# EAGLE design sr42-revB-mlb (EAGLE 9.6.2)

## Sheet 1 of 2
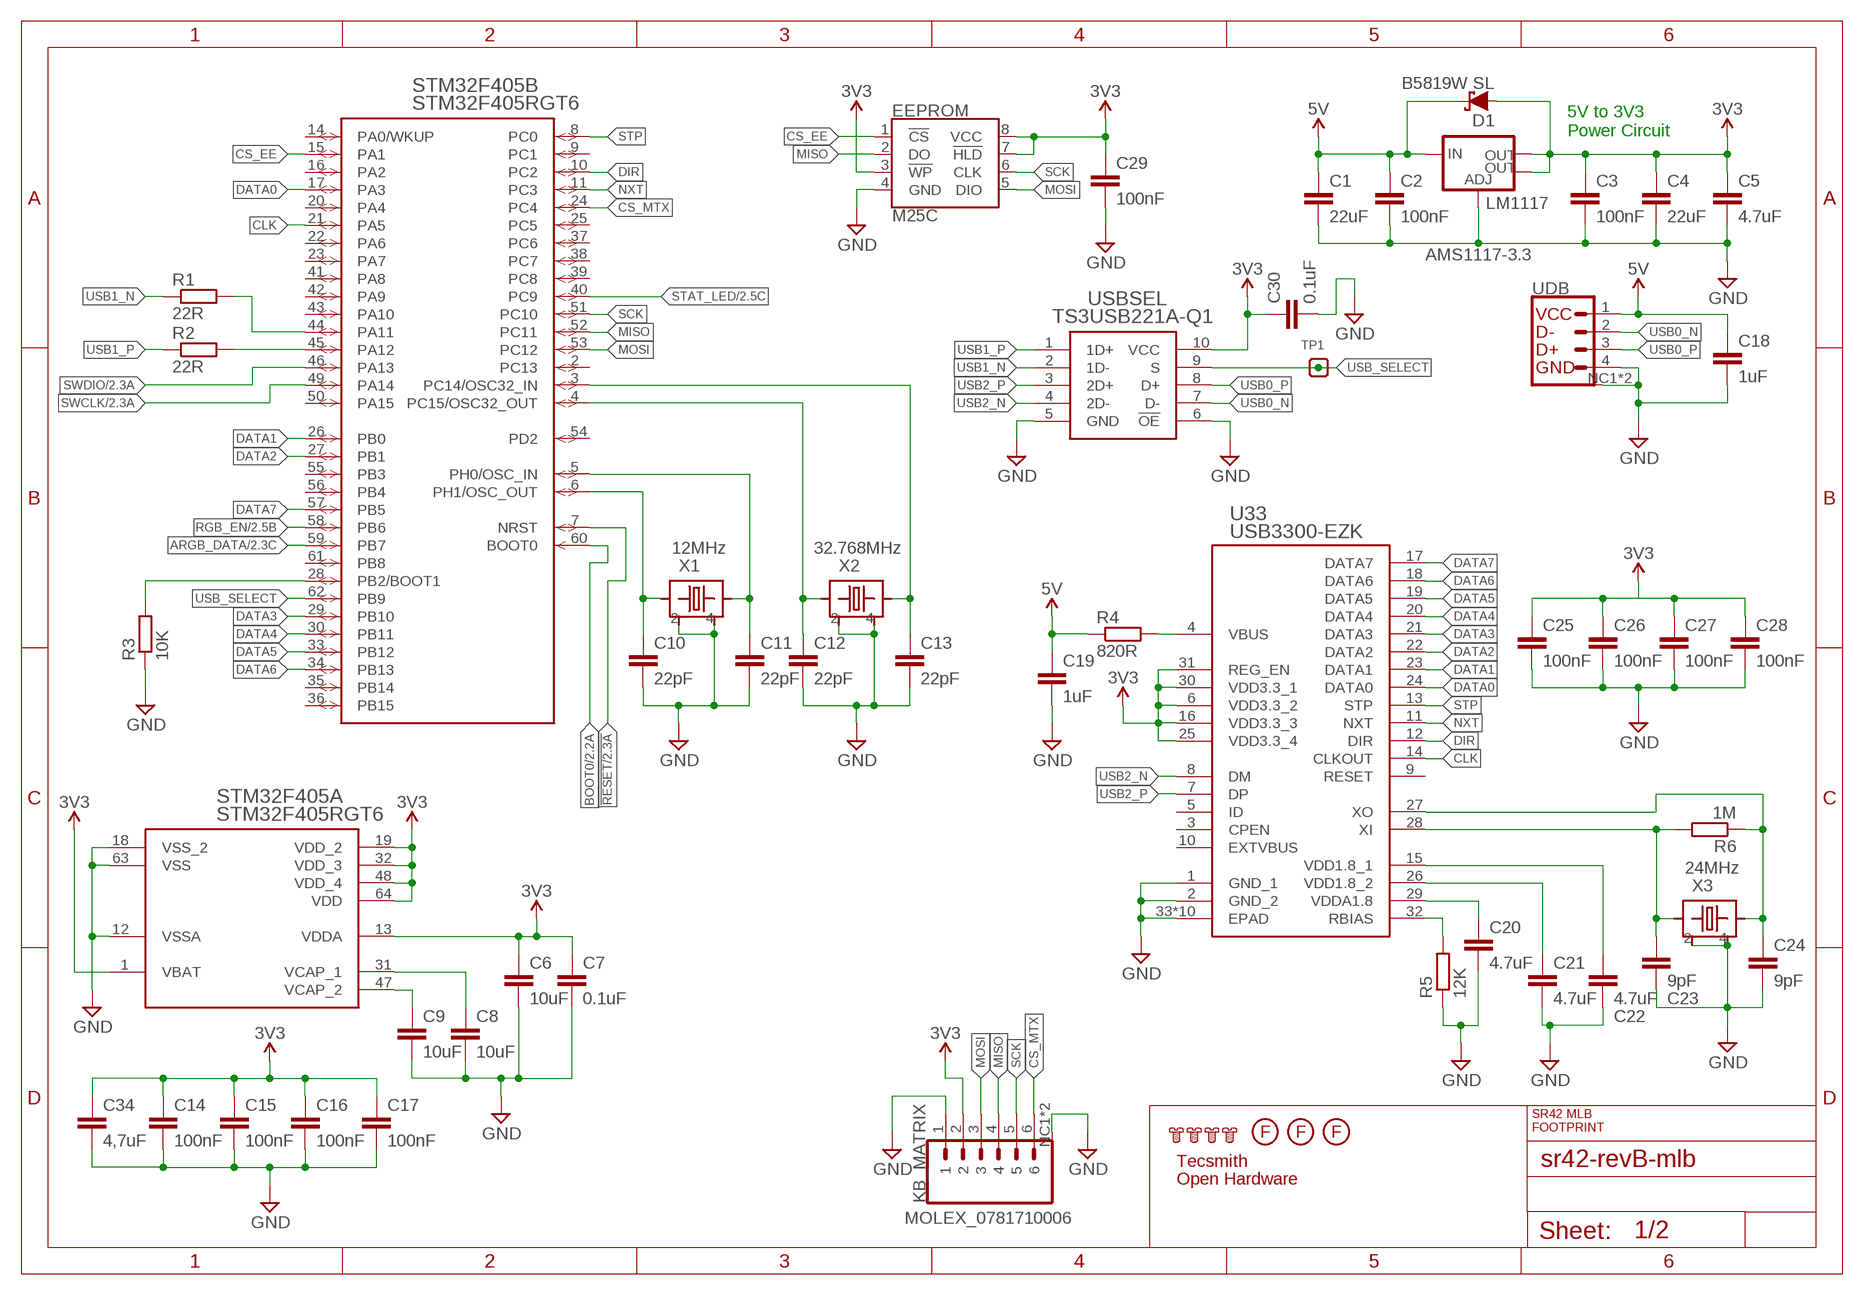
[diagram p0: schematic, sheet 1]

### Parts
C1  22uF  C-EUC0603  [C0603]
C2  100nF  C-EUC0603  [C0603]
C3  100nF  C-EUC0603  [C0603]
C4  22uF  C-EUC0603  [C0603]
C5  4.7uF  C-EUC0603  [C0603]
C6  10uF  C-EUC0603  [C0603]
C7  0.1uF  C-EUC0603  [C0603]
C8  10uF  C-EUC0603  [C0603]
C9  10uF  C-EUC0603  [C0603]
C10  22pF  C-EUC0603  [C0603]
C11  22pF  C-EUC0603  [C0603]
C12  22pF  C-EUC0603  [C0603]
C13  22pF  C-EUC0603  [C0603]
C14  100nF  C-EUC0603  [C0603]
C15  100nF  C-EUC0603  [C0603]
C16  100nF  C-EUC0603  [C0603]
C17  100nF  C-EUC0603  [C0603]
C18  1uF  C-EUC0603  [C0603]
C19  1uF  C-EUC0603  [C0603]
C20  4.7uF  C-EUC0603  [C0603]
C21  4.7uF  C-EUC0603  [C0603]
C22  4.7uF  C-EUC0603  [C0603]
C23  9pF  C-EUC0603  [C0603]
C24  9pF  C-EUC0603  [C0603]
C25  100nF  C-EUC0603  [C0603]
C26  100nF  C-EUC0603  [C0603]
C27  100nF  C-EUC0603  [C0603]
C28  100nF  C-EUC0603  [C0603]
C29  100nF  C-EUC0603  [C0603]
C30  0.1uF  C-EUC0603  [C0603]
C34  4,7uF  C-EUC0603  [C0603]
D1  B5819W SL  1N5819WS  [SOD-123]
EEPROM  M25C  [8-SOIC]
KB_MATRIX  MOLEX_0781710006  [MOLEX_781710006]
LM1117  AMS1117-3.3  V_REG_LM1117SOT223  [SOT223]
LOGO1  OSHW-LOGOM  [OSHW-LOGO-M]
R1  22R  R-EU_R0603  [R0603]
R2  22R  R-EU_R0603  [R0603]
R3  10K  R-EU_R0603  [R0603]
R4  820R  R-EU_R0603  [R0603]
R5  12K  R-EU_R0603  [R0603]
R6  1M  R-EU_R0603  [R0603]
STM32F405  STM32F405RGT6  [LQFP64-10X10MM]
TP1  TEST-POINT.3RN  [PAD.03X.03-RN]
U33  USB3300-EZK  [QFN32_5X5MC_MCH]
U$1  SR42_MLB_FOOTPRINT  [SR42_MLB_FOOTPRINT]
U$2  MOUNTING-HOLE  [MOUNTING-HOLE]
U$3  MOUNTING-HOLE  [MOUNTING-HOLE]
U$4  MOUNTING-HOLE  [MOUNTING-HOLE]
U$5  MOUNTING-HOLE  [MOUNTING-HOLE]
U$6  TECSMITH-LOGOLONG  [TECSMITH-NAME]
U$7  FIDUCIAL  [FIDUCIAL]
U$8  FIDUCIAL  [FIDUCIAL]
U$9  FIDUCIAL  [FIDUCIAL]
UDB  UBD-S1_C4  [MOLEX_781710004]
USBSEL  TS3USB221A-Q1  [RSE10]
X1  12MHz  CRYSTAL2.5X2.0  [CRYSTAL_2.5X2]
X2  32.768MHz  CRYSTAL2.5X2.0  [CRYSTAL_2.5X2]
X3  24MHz  CRYSTAL2.5X2.0  [CRYSTAL_2.5X2]

### Nets
!RESET: STM32F405.7(B:NRST) ; also sheet 2
ARGB_DATA: STM32F405.59(B:PB7) ; also sheet 2
BOOT0: STM32F405.60(B:BOOT0) ; also sheet 2
BOOT1: R3.2 STM32F405.28(B:PB2/BOOT1)
CLK: STM32F405.21(B:PA5) U33.14(CLKOUT)
CS_EE: EEPROM.1(!CS) STM32F405.15(B:PA1)
CS_MTX: KB_MATRIX.6 STM32F405.24(B:PC4)
DATA0: STM32F405.17(B:PA3) U33.24(DATA0)
DATA1: STM32F405.26(B:PB0) U33.23(DATA1)
DATA2: STM32F405.27(B:PB1) U33.22(DATA2)
DATA3: STM32F405.29(B:PB10) U33.21(DATA3)
DATA4: STM32F405.30(B:PB11) U33.20(DATA4)
DATA5: STM32F405.33(B:PB12) U33.19(DATA5)
DATA6: STM32F405.34(B:PB13) U33.18(DATA6)
DATA7: STM32F405.57(B:PB5) U33.17(DATA7)
DIR: STM32F405.10(B:PC2) U33.12(DIR)
GND [gnd]: C1.2 C2.2 C3.2 C4.2 C5.2 C6.2 C7.2 C8.2 C9.2 C10.2 C11.2 C12.2 C13.2 C14.2 C15.2 C16.2 C17.2 C18.2 C19.2 C20.2 C21.2 C22.2 C23.2 C24.2 C25.2 C26.2 C27.2 C28.2 C29.2 C30.2 C34.2 EEPROM.4(GND) KB_MATRIX.1 KB_MATRIX.NC1(M) KB_MATRIX.NC2(M) LM1117.1(ADJ) R3.1 R5.1 STM32F405.12(A:VSSA) STM32F405.18(A:VSS_2) STM32F405.63(A:VSS) U33.1(GND_1) U33.2(GND_2) U33.33(EPAD) U33.P$1(EPAD) U33.P$2(EPAD) U33.P$3(EPAD) U33.P$4(EPAD) U33.P$5(EPAD) U33.P$6(EPAD) U33.P$7(EPAD) U33.P$8(EPAD) U33.P$9(EPAD) UDB.4(GND) UDB.NC1(M) UDB.NC2(M) USBSEL.5(GND) USBSEL.6(!OE) X1.2 X1.4 X2.2 X2.4 X3.2 X3.4 ; also sheet 2
MISO: EEPROM.2(DO) KB_MATRIX.4 STM32F405.52(B:PC11)
MOSI: EEPROM.5(DIO) KB_MATRIX.3 STM32F405.53(B:PC12)
N$1: R1.2 STM32F405.44(B:PA11)
N$4: R2.2 STM32F405.45(B:PA12)
N$5: R4.2 U33.4(VBUS)
N$6: C20.1 U33.29(VDDA1.8)
N$7: C21.1 U33.26(VDD1.8_2)
N$8: C22.1 U33.15(VDD1.8_1)
N$9: C23.1 R6.2 U33.28(XI) X3.1
N$10: C24.1 R6.1 U33.27(XO) X3.3
NXT: STM32F405.11(B:PC3) U33.11(NXT)
OSC32_IN: C13.1 STM32F405.3(B:PC14/OSC32_IN) X2.3
OSC32_OUT: C12.1 STM32F405.4(B:PC15/OSC32_OUT) X2.1
OSC_IN: C11.1 STM32F405.5(B:PH0/OSC_IN) X1.3
OSC_OUT: C10.1 STM32F405.6(B:PH1/OSC_OUT) X1.1
RBIAS: R5.2 U33.32(RBIAS)
RGB_EN: STM32F405.58(B:PB6) ; also sheet 2
SCK: EEPROM.6(CLK) KB_MATRIX.5 STM32F405.51(B:PC10)
STAT_LED: STM32F405.40(B:PC9) ; also sheet 2
STP: STM32F405.8(B:PC0) U33.13(STP)
SWCLK: STM32F405.49(B:PA14) ; also sheet 2
SWDIO: STM32F405.46(B:PA13) ; also sheet 2
USB0_N: UDB.2(DN) USBSEL.7(D-)
USB0_P: UDB.3(DP) USBSEL.8(D+)
USB1_N: R1.1 USBSEL.2(1D-)
USB1_P: R2.1 USBSEL.1(1D+)
USB2_N: U33.8(DM) USBSEL.4(2D-)
USB2_P: U33.7(DP) USBSEL.3(2D+)
USB_SELECT: STM32F405.62(B:PB9) TP1.1 USBSEL.9(S)
VCAP1: C8.1 STM32F405.31(A:VCAP_1)
VCAP2: C9.1 STM32F405.47(A:VCAP_2)
VCC_1: C1.1 C2.1 C18.1 C19.1 D1.C LM1117.3(IN) R4.1 UDB.1(VCC) ; supply symbol labelled 5V ; also sheet 2
VCC_2: C3.1 C4.1 C5.1 C6.1 C7.1 C14.1 C15.1 C16.1 C17.1 C25.1 C26.1 C27.1 C28.1 C29.1 C30.1 C34.1 D1.A EEPROM.3(!WP) EEPROM.7(!HLD) EEPROM.8(VCC) KB_MATRIX.2 LM1117.2(OUT) LM1117.4(OUT) STM32F405.1(A:VBAT) STM32F405.13(A:VDDA) STM32F405.19(A:VDD_2) STM32F405.32(A:VDD_3) STM32F405.48(A:VDD_4) STM32F405.64(A:VDD) U33.6(VDD3.3_2) U33.16(VDD3.3_3) U33.25(VDD3.3_4) U33.30(VDD3.3_1) U33.31(REG_EN) USBSEL.10(VCC) ; supply symbol labelled 3V3 ; also sheet 2
Unconnected: STM32F405.2(B:PC13) STM32F405.9(B:PC1) STM32F405.14(B:PA0/WKUP) STM32F405.16(B:PA2) STM32F405.20(B:PA4) STM32F405.22(B:PA6) STM32F405.23(B:PA7) STM32F405.25(B:PC5) STM32F405.35(B:PB14) STM32F405.36(B:PB15) STM32F405.37(B:PC6) STM32F405.38(B:PC7) STM32F405.39(B:PC8) STM32F405.41(B:PA8) STM32F405.42(B:PA9) STM32F405.43(B:PA10) STM32F405.50(B:PA15) STM32F405.54(B:PD2) STM32F405.55(B:PB3) STM32F405.56(B:PB4) STM32F405.61(B:PB8) U33.3(CPEN) U33.5(ID) U33.9(RESET) U33.10(EXTVBUS)

### Notes on the sheet
- 5V to 3V3
  Power Circuit

## Sheet 2 of 2
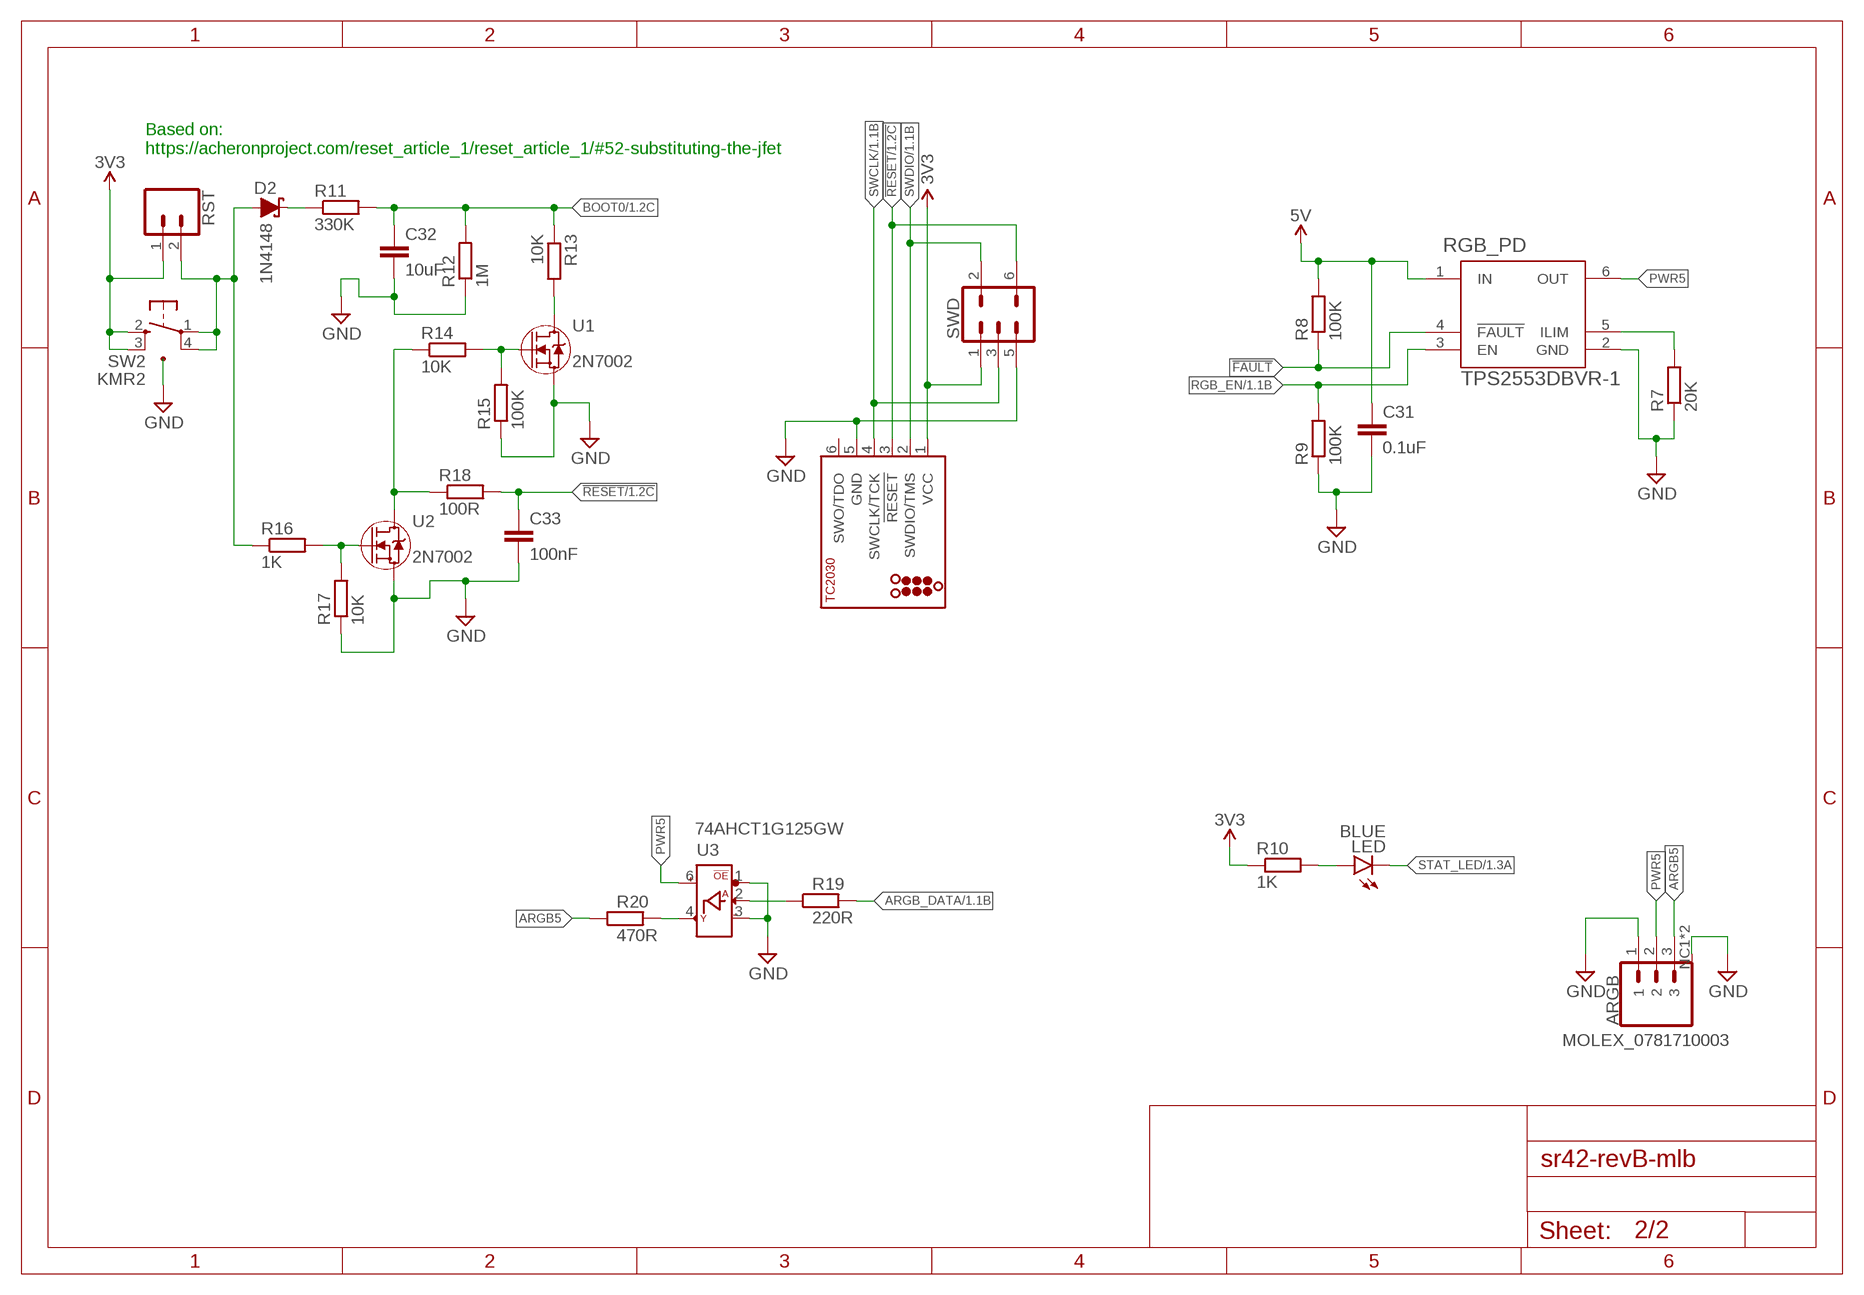
[diagram p1: schematic, sheet 2]

### Parts
ARGB  MOLEX_0781710003  [MOLEX_781710003]
C31  0.1uF  C-EUC0603  [C0603]
C32  10uF  C-EUC0603  [C0603]
C33  100nF  C-EUC0603  [C0603]
D2  1N4148  1N5819WS  [SOD-123]
LED  BLUE  LEDSML0603  [SML0603]
R7  20K  R-EU_R0603  [R0603]
R8  100K  R-EU_R0603  [R0603]
R9  100K  R-EU_R0603  [R0603]
R10  1K  R-EU_R0603  [R0603]
R11  330K  R-EU_R0603  [R0603]
R12  1M  R-EU_R0603  [R0603]
R13  10K  R-EU_R0603  [R0603]
R14  10K  R-EU_R0603  [R0603]
R15  100K  R-EU_R0603  [R0603]
R16  1K  R-EU_R0603  [R0603]
R17  10K  R-EU_R0603  [R0603]
R18  100R  R-EU_R0603  [R0603]
R19  220R  R-EU_R0603  [R0603]
R20  470R  R-EU_R0603  [R0603]
RGB_PD  TPS2553DBVR-1  [DBV0006A_N]
RST  CONN_02  [1X02]
SW2  KMR2  KMR221GLFSSW4_KMR221GLFS_CNK  [SW4_KMR221GLFS_CNK]
SWD  SWD-5PIN  [PAD_05_03X2_TP_NO4]
TC  TC2030-MCP-NL  [TC2030-MCP-NL]
U1  2N7002  [TO-236AB_NEX]
U2  2N7002  [TO-236AB_NEX]
U3  74AHCT1G125GW  [SC-88A__TSSOP5__SOT353-1]

### Nets
!FAULT: R8.1 RGB_PD.4(!FAULT)
!RESET: C33.1 R18.2 SWD.6 TC.3(!RESET) ; also sheet 1
ARGB5: ARGB.3 R20.1
ARGB_DATA: R19.2 ; also sheet 1
BOOT0: C32.1 R11.2 R12.2 R13.1 ; also sheet 1
GND [gnd]: ARGB.1 ARGB.NC1(M) ARGB.NC2(M) C31.2 C32.2 C33.2 R7.1 R9.1 R12.1 R15.1 R17.1 RGB_PD.2(GND) SW2.5 SWD.5 TC.5(GND) U1.2 U2.2 U3.1(!OE) U3.3(3_GND) ; also sheet 1
N$11: D2.C R11.1
N$12: LED.A R10.2
N$14: R7.2 RGB_PD.5(ILIM)
N$15: R14.1 R18.1 U2.3
N$16: R13.2 U1.3
N$17: R14.2 R15.2 U1.1
N$18: R19.1 U3.2(A_DIN)
N$19: R16.2 R17.2 U2.1
N$20: D2.A R16.1 RST.2 SW2.1 SW2.4
N$22: R20.2 U3.4(Y_DOUT)
PWR5: ARGB.2 RGB_PD.6(OUT) U3.6(5_VCC)
RGB_EN: R9.2 RGB_PD.3(EN) ; also sheet 1
STAT_LED: LED.C ; also sheet 1
SWCLK: SWD.3 TC.4(SWCLK/TCK) ; also sheet 1
SWDIO: SWD.2 TC.2(SWDIO/TMS) ; also sheet 1
VCC_1: C31.1 R8.2 RGB_PD.1(IN) ; supply symbol labelled 5V ; also sheet 1
VCC_2: R10.1 RST.1 SW2.2 SW2.3 SWD.1 TC.1(VCC) ; supply symbol labelled 3V3 ; also sheet 1
Unconnected: TC.6(SWO/TDO)

### Notes on the sheet
- Based on:
  https://acheronproject.com/reset_article_1/reset_article_1/#52-substituting-the-jfet

## Power pins joined to a net without a drawn wire
P$1: U$2.P$1 U$2.P$2 U$2.P$3 U$2.P$4 U$2.P$5 U$2.P$6 U$3.P$1 U$3.P$2 U$3.P$3 U$3.P$4 U$3.P$5 U$3.P$6 U$4.P$1 U$4.P$2 U$4.P$3 U$4.P$4 U$4.P$5 U$4.P$6 U$5.P$1 U$5.P$2 U$5.P$3 U$5.P$4 U$5.P$5 U$5.P$6

## Library data of the parts
ARGB = molex-pico-ezmate:MOLEX_0781710003
C1-C34 = rcl:C-EU: CAPACITOR, European symbol; SPICEPREFIX: C
D1 D2 = tecsmith_jlcpcb_basic_parts:1N5819WS: JLCPCB Part # C8598 Description 40V 600mV@1A 1A SOD-123 Schottky Barrier Diodes (SBD) ROHS Schottky Diode
EEPROM = ts_kb_mcu:M25C
KB_MATRIX = molex-pico-ezmate:MOLEX_0781710006
LED = led:LED: LED OSRAM: - CHIPLED LG R971, LG N971, LY N971, LG Q971, LY Q971, LO R971, LY R971 LH N974, LH R974 LS Q976, LO Q976, LY Q976 LO Q996 - Hyper CHIPLED LW Q18S LB Q993, LB Q99A, LB R99A - SideLED LS A670, LO A670, LY A670, LG A670, LP A670 LB A673, LV A673, LT A673, LW A673 LH A674 LY A675 LS A676, LA A676, LO A676, LY A676, LW A676 LS A679, LY A679, LG A679 - Hyper Micro SIDELED® LS Y876, LA Y876, LO Y876, LY Y876 LT Y87S - SmartLED LW L88C, LW L88S LB L89C, LB L89S, LG L890 LS L89K, LO L89K, LY L89K LS L896, LA L896, LO L896, LY L896 - TOPLED LS T670, LO T670, LY T670, LG T670, LP T670 LSG T670, LSP T670, LSY T670, LOP T670, LYG T670 LG T671, LOG T671, LSG T671 LB T673, LV T673, LT T673, LW T673 LH T674 LS T676, LA T676, LO T676, LY T676, LB T676, LH T676, LSB T676, LW T676 LB T67C, LV T67C, LT T67C, LS T67K, LO T67K, LY T67K, LW E67C LS E67B, LA E67B, LO E67B, LY E67B, LB E67C, LV E67C, LT E67C LW T67C LS T679, LY T679, LG T679 LS T770, LO T770, LY T770, LG T770, LP T770 LB T773, LV T773, LT T773, LW T773 LH T774 LS E675, LA E675, LY E675, LS T675 LS T776, LA T776, LO T776, LY T776, LB T776 LHGB T686 LT T68C, LB T68C - Hyper Mini TOPLED® LB M676 - Mini TOPLED Santana® LG M470 LS M47K, LO M47K, LY M47K Source: http://www.osram.convergy.de LUXEON: - LUMILED® LXK2-PW12-R00, LXK2-PW12-S00, LXK2-PW14-U00, LXK2-PW14-V00 LXK2-PM12-R00, LXK2-PM12-S00, LXK2-PM14-U00 LXK2-PE12-Q00, LXK2-PE12-R00, LXK2-PE12-S00, LXK2-PE14-T00, LXK2-PE14-U00 LXK2-PB12-K00, LXK2-PB12-L00, LXK2-PB12-M00, LXK2-PB14-N00, LXK2-PB14-P00, LXK2-PB14-Q00 LXK2-PR12-L00, LXK2-PR12-M00, LXK2-PR14-Q00, LXK2-PR14-R00 LXK2-PD12-Q00, LXK2-PD12-R00, LXK2-PD12-S00 LXK2-PH12-R00, LXK2-PH12-S00 LXK2-PL12-P00, LXK2-PL12-Q00, LXK2-PL12-R00 Source: www.luxeon.com KINGBRIGHT: KA-3528ASYC Source: www.kingbright.com
LM1117 = SparkFun-IC-Power:V_REG_LM1117: Voltage Regulator LM1117 Standard adjustable voltage regulator but in SMD form. Spark Fun Electronics SKU : COM-00595; PROD_ID: VREG-08170
LOGO1 = random_logos:OSHW-LOGO: Open-Source Hardware (OSHW) Logo This logo indicates the piece of hardware it is found on incorporates a OSHW license and/or adheres to the definition of open source hardware found here: http://freedomdefined.org/OSHW
R1-R20 = rcl:R-EU_: RESISTOR, European symbol; SPICEPREFIX: R
RGB_PD = __untitled:TPS2553DBVR-1; COPYRIGHT: Copyright (C) 2024 Ultra Librarian. All rights reserved.; MANUFACTURER_PART_NUMBER: TPS2553DBVR-1; MFR_NAME: Texas Instruments; REFDES: RefDes; TYPE: TYPE
RST = SparkFun-Connectors:CONN_02: Multi connection point. Often used as Generic Header-pin footprint for 0.1 inch spaced/style header connections On any of the 0.1 inch spaced packages, you can populate with these: Break Away Headers - Straight <https://www.sparkfun.com/products/116> (PRT-00116) Break Away Male Headers - Right Angle <https://www.sparkfun.com/products/553> (PRT-00553) Female Headers <https://www.sparkfun.com/products/115> (PRT-00115) Break Away Headers - Machine Pin <https://www.sparkfun.com/products/117> (PRT-00117) Break Away Female Headers - Swiss Machine Pin <https://www.sparkfun.com/products/743> (PRT-00743) For SCREWTERMINALS and SPRING TERMINALS visit here: Screw Terimnals on SparkFun.com <https://www.sparkfun.com/search/results?term=Screw+Terminals> (5mm/3.5mm/2.54mm spacing) This device is also useful as a general connection point to wire up your design to another part of your project. Our various solder wires solder well into these plated through hole pads. Hook-Up Wire - Assortment (Stranded, 22 AWG) <https://www.sparkfun.com/products/11375> (PRT-11375) Hook-Up Wire - Assortment (Solid Core, 22 AWG) <https://www.sparkfun.com/products/11367> (PRT-11367) View the entire wire category on our website here <https://www.sparkfun.com/categories/141> Special notes: Molex polarized connector foot print use with: PRT-08233 with associated crimp pins and housings. 2.54_SCREWTERM for use with PRT-10571. 3.5mm Screw Terminal footprints for PRT-08084 5mm Screw Terminal footprints for use with PRT-08432
STM32F405 = st:STM32F405RGT6
SW2 = 2024-11-04_19-55-01_Library:KMR221GLFS
SWD = SparkFun-Connectors:SWD-5PIN: 5-pin SWD connector Test-point based header for SWD. Pin 1 - PWR Pin 2 - SWDIO Pin 3 - SWCLK Pin 4 - NC Pin 5 - GND Pin 6 - RESET
TC = __untitled:TC2030: TAG-CONNECT ICSP Connector Manufacturer: Tag-Connect <http://www.tag-connect.com> Cable for easy In-Circuit Serial Programming. Designed for Microchip ICD2, suitable for many others. Two variants - one "with legs" (for hands-free fit on PCB) and another "without legs" for quick programming. PAD Description 1 MCLR/Vpp 2 Vdd 3 GND 4 PGD (ISPDAT) 5 PGC (ISPCLK) 6 nc (used for LVP) ©2009 ROFA.cz - modified and updated by Robert Darlington ‹rdarlington@gmail.com›
TP1 = tecsmith_keyboards:TEST-POINT
U1 U2 = __temp_to_delete:2N7002; COPYRIGHT: Copyright (C) 2024 Ultra Librarian. All rights reserved.; MANUFACTURER_PART_NUMBER: 2N7002,215; MFR_NAME: Nexperia
U3 = ts_keyboards:74AHCT1G125GW
U33 = ts_kb_mcu:USB3300-EZK; COPYRIGHT: Copyright (C) 2023 Ultra Librarian. All rights reserved.; MANUFACTURER_PART_NUMBER: USB3300-EZK; MFR_NAME: Microchip
U$1 = __temp_to_delete:SR42_MLB_FOOTPRINT
U$2-U$5 = ts_keyboards:MOUNTING-HOLE
U$6 = random_logos:TECSMITH-LOGO
U$7-U$9 = __temp_to_delete:FIDUCIAL
UDB = ts_keyboards:UBD-S1_C4: SMD 1.2mm pitch Molex Pico-EZmate 4P connector
USBSEL = ts_kb_mcu:TS3USB221A-Q1; COPYRIGHT: Copyright (C) 2023 Ultra Librarian. All rights reserved.; MANUFACTURER_PART_NUMBER: TS3USB221AQRSERQ1; MFR_NAME: Texas Instruments
X1-X3 = __temp_to_delete:CRYSTAL

## Net classes
1 power: width 0.305 mm
2 gnd: width 0.254 mm

## Board
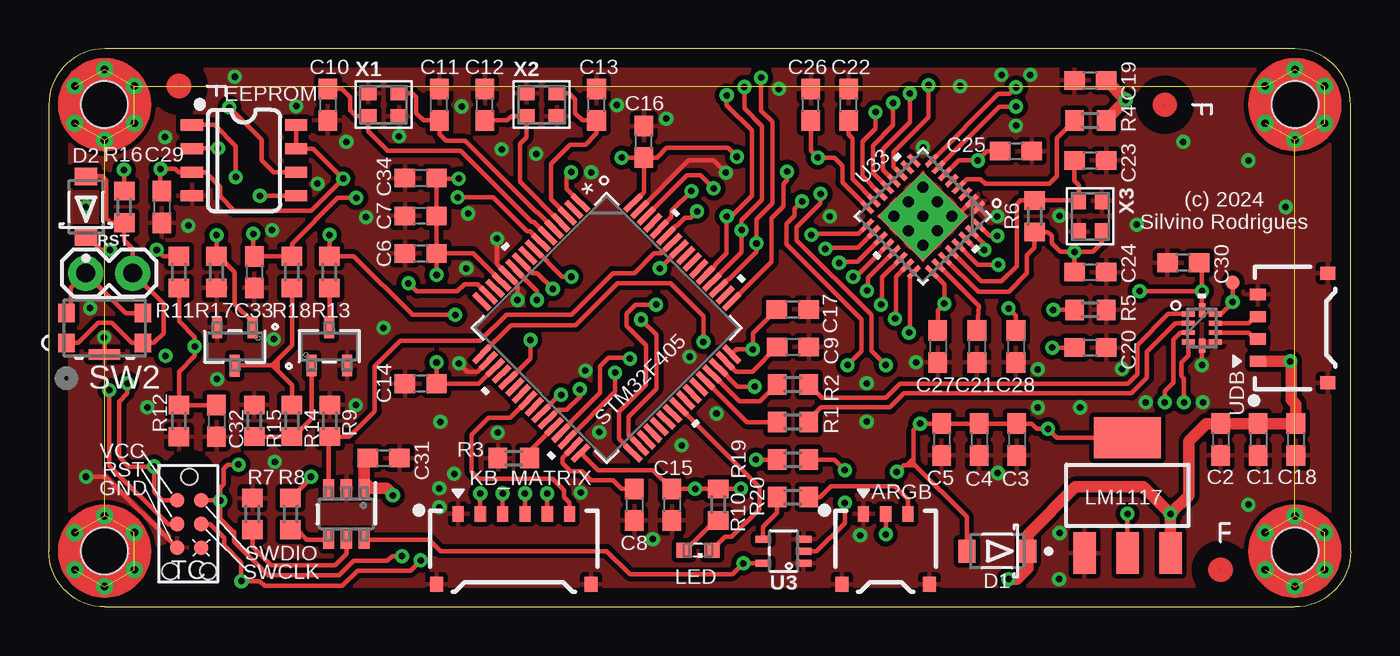
[diagram p2: board, top side]
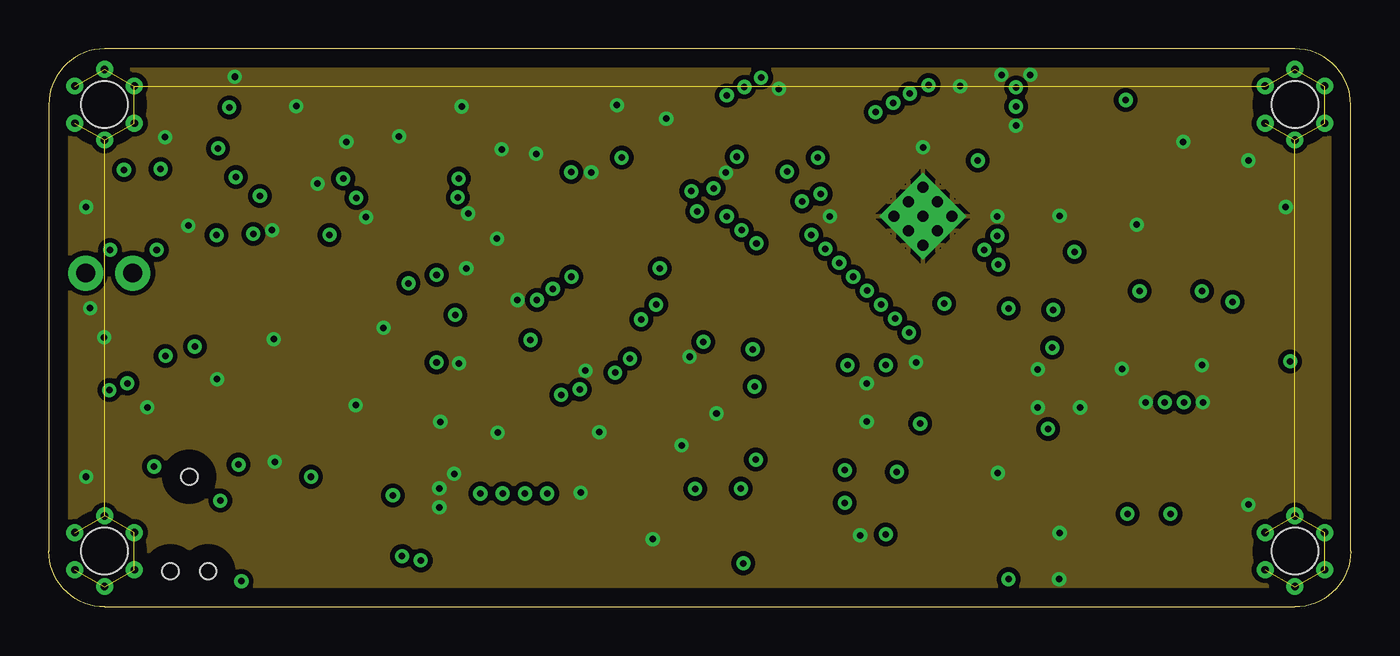
[diagram p3: board, inner layer Route2]
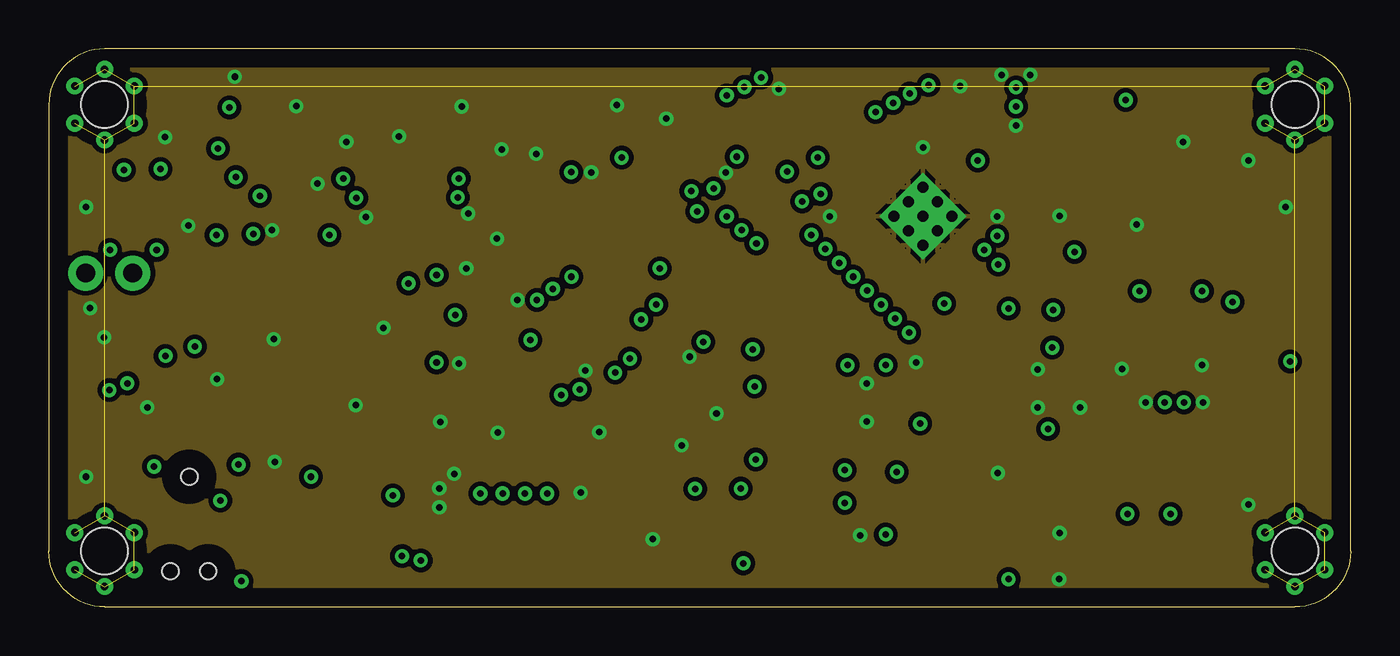
[diagram p4: board, inner layer Route15]
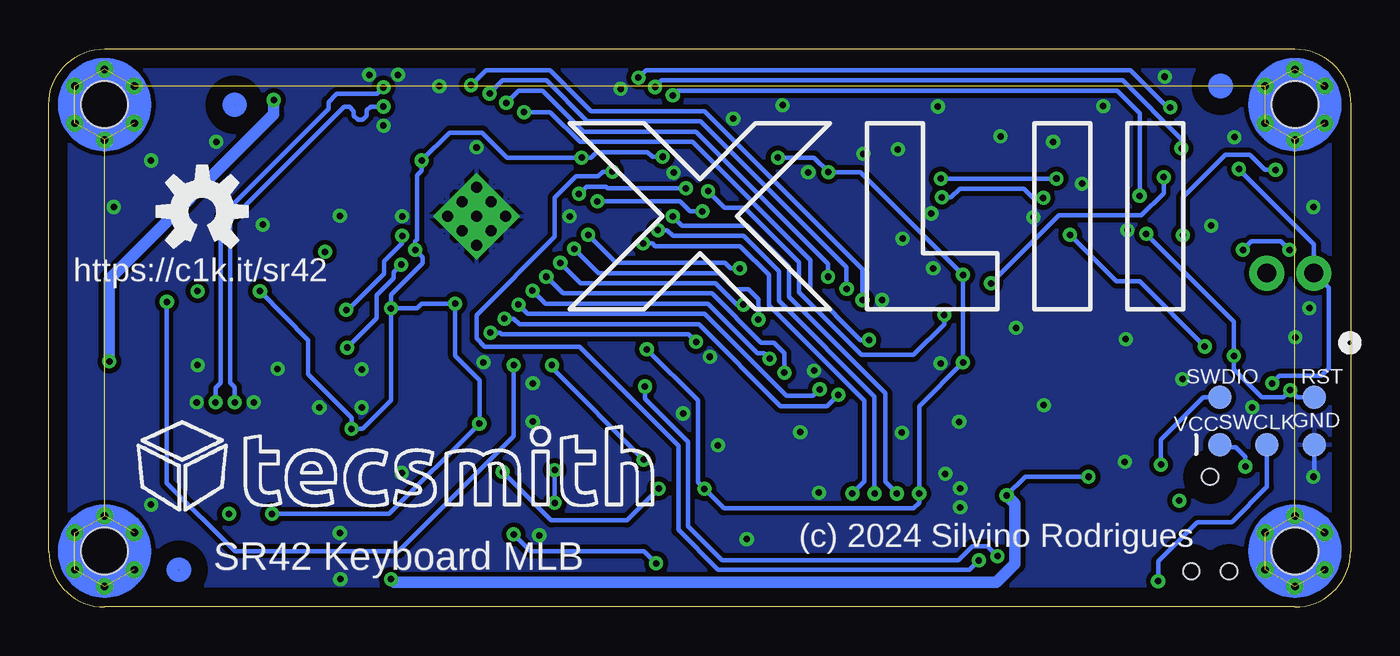
[diagram p5: board, bottom side, seen from below]

Size 70 x 30 mm. Coordinates in mm from the lower left corner, seen from the top.
Outline: 3,0 67,0 arc90 70,3 70,27 arc90 67,30 3,30 arc90 0,27 0,3 arc90 3,0
Copper layers (1+2*15+16): Top 0.035mm / dielectric 0.2mm / Route2 0.0175mm / dielectric 1.065mm / Route15 0.0175mm / dielectric 0.2mm / Bottom 0.035mm
Design rules "default *": minimum track width 6mil, minimum drill 0.35mm, track to track 10mil, track to pad 10mil, pad to pad 10mil, via to via 10mil, smd to smd 10mil, copper to edge 40mil, drill to drill 6mil, minimum pad ring 10mil, minimum via ring 8mil, stop-mask expansion 4mil, vias tented up to drill 0mil, thermal gap 10mil

### Footprints (pad centres in the part's own frame; a part is rotated, then mirrored left to right if it is on the bottom)
MOLEX_781710003 = smd 0.6 x 0.85: 1 -1.2,2; 2 0,2; 3 1.2,2 | smd 0.7 x 0.8: NC1 -2.35,-1.775; NC2 2.35,-1.775
C0603 = smd 1.1 x 1: 1 -0.85,0; 2 0.85,0
SOD-123 = smd 0.914 x 1.219: A 1.638,0; C -1.638,0
8-SOIC = smd 0.6 x 1.2: 1 -1.905,-2.8; 2 -0.635,-2.8; 3 0.635,-2.8; 4 1.905,-2.8; 5 1.905,2.8; 6 0.635,2.8; 7 -0.635,2.8; 8 -1.905,2.8
MOLEX_781710006 = smd 0.6 x 0.85: 1 -3,2; 2 -1.8,2; 3 -0.6,2; 4 0.6,2; 5 1.8,2; 6 3,2 | smd 0.7 x 0.8: NC1 -4.15,-1.775; NC2 4.15,-1.775
SML0603 = smd 0.8 x 0.8: A 0.75,0; C -0.75,0
SOT223 = smd 1.219 x 2.235: 1 -2.311,-3.099; 2 0,-3.099; 3 2.311,-3.099 | smd 3.6 x 2.2: 4 0,3.099
R0603 = smd 1 x 1.1: 1 -0.85,0; 2 0.85,0
DBV0006A_N = smd 1 x 0.6: 1 -1.375,0.95; 2 -1.375,0; 3 -1.375,-0.95; 4 1.375,-0.95; 5 1.375,0; 6 1.375,0.95
1X02 = drill 1.016 pad 1.88: 1 0,0; 2 2.54,0
LQFP64-10X10MM = smd 1.194 x 0.305: 1 -5.75,3.75; 2 -5.75,3.25; 3 -5.75,2.75; 4 -5.75,2.25; 5 -5.75,1.75; 6 -5.75,1.25; 7 -5.75,0.75; 8 -5.75,0.25; 9 -5.75,-0.25; 10 -5.75,-0.75; 11 -5.75,-1.25; 12 -5.75,-1.75; 13 -5.75,-2.25; 14 -5.75,-2.75; 15 -5.75,-3.25; 16 -5.75,-3.75; 33 5.75,-3.75; 34 5.75,-3.25; 35 5.75,-2.75; 36 5.75,-2.25; 37 5.75,-1.75; 38 5.75,-1.25; 39 5.75,-0.75; 40 5.75,-0.25; 41 5.75,0.25; 42 5.75,0.75; 43 5.75,1.25; 44 5.75,1.75; 45 5.75,2.25; 46 5.75,2.75; 47 5.75,3.25; 48 5.75,3.75 | smd 0.305 x 1.194: 17 -3.75,-5.75; 18 -3.25,-5.75; 19 -2.75,-5.75; 20 -2.25,-5.75; 21 -1.75,-5.75; 22 -1.25,-5.75; 23 -0.75,-5.75; 24 -0.25,-5.75; 25 0.25,-5.75; 26 0.75,-5.75; 27 1.25,-5.75; 28 1.75,-5.75; 29 2.25,-5.75; 30 2.75,-5.75; 31 3.25,-5.75; 32 3.75,-5.75; 49 3.75,5.75; 50 3.25,5.75; 51 2.75,5.75; 52 2.25,5.75; 53 1.75,5.75; 54 1.25,5.75; 55 0.75,5.75; 56 0.25,5.75; 57 -0.25,5.75; 58 -0.75,5.75; 59 -1.25,5.75; 60 -1.75,5.75; 61 -2.25,5.75; 62 -2.75,5.75; 63 -3.25,5.75; 64 -3.75,5.75
SW4_KMR221GLFS_CNK = smd 0.889 x 0.991: 1 2.05,0.8; 2 2.05,-0.8; 3 -2.05,-0.8; 4 -2.05,0.8 | smd 1.7 x 0.55: 5 0,1.425
PAD_05_03X2_TP_NO4 = smd 1.27 x 1.27: 1 -2.54,-1.27; 2 -2.54,1.27; 3 0,-1.27; 5 2.54,-1.27; 6 2.54,1.27
TC2030-MCP-NL = smd 0.787 x 0.787: 1 1.27,-0.635; 2 1.27,0.635; 3 2.54,-0.635; 4 2.54,0.635; 5 3.81,-0.635; 6 3.81,0.635 | hole 0.889: 0,0; 5.08,-1.016; 5.08,1.016
PAD.03X.03-RN = smd 0.762 x 0.762: 1 0,0
TO-236AB_NEX = smd 0.533 x 1.168: 1 -0.953,-1.029; 2 0.953,-1.029; 3 0,1.029
SC-88A__TSSOP5__SOT353-1 = smd 0.375 x 0.825: 1 -0.65,-1.087; 2 0,-1.087; 3 0.65,-1.087; 4 0.65,1.087; 6 -0.65,1.087
QFN32_5X5MC_MCH = smd 0.813 x 0.254: 1 -2.451,1.778; 2 -2.451,1.27; 3 -2.451,0.762; 4 -2.451,0.254; 5 -2.451,-0.254; 6 -2.451,-0.762; 7 -2.451,-1.27; 8 -2.451,-1.778; 17 2.451,-1.778; 18 2.451,-1.27; 19 2.451,-0.762; 20 2.451,-0.254; 21 2.451,0.254; 22 2.451,0.762; 23 2.451,1.27; 24 2.451,1.778 | smd 0.254 x 0.813: 9 -1.778,-2.451; 10 -1.27,-2.451; 11 -0.762,-2.451; 12 -0.254,-2.451; 13 0.254,-2.451; 14 0.762,-2.451; 15 1.27,-2.451; 16 1.778,-2.451; 25 1.778,2.451; 26 1.27,2.451; 27 0.762,2.451; 28 0.254,2.451; 29 -0.254,2.451; 30 -0.762,2.451; 31 -1.27,2.451; 32 -1.778,2.451 | smd 3.404 x 3.404: 33 0,0 | drill 0.6 square: P$1 -1.1,1.1; P$2 0,1.1; P$3 1.1,1.1; P$4 -1.1,0; P$5 0,0; P$6 1.1,0; P$7 -1.1,-1.1; P$8 0,-1.1; P$9 1.1,-1.1
MOUNTING-HOLE = drill 0.4: P$1 0,1.9; P$2 1.6,1; P$3 1.6,-1; P$4 0,-1.9; P$5 -1.6,-1; P$6 -1.6,1 | hole 2.5: 0,0
MOLEX_781710004 = smd 0.6 x 0.85: 1 -1.8,2; 2 -0.6,2; 3 0.6,2; 4 1.8,2 | smd 0.7 x 0.8: NC1 -2.95,-1.775; NC2 2.95,-1.775
RSE10 = smd 0.705 x 0.3: 1 -0.727,0.75; 4 -0.727,-0.75; 6 0.727,-0.75; 9 0.727,0.75 | smd 0.705 x 0.25: 2 -0.727,0.25; 3 -0.727,-0.25; 7 0.727,-0.25; 8 0.727,0.25 | smd 0.35 x 0.755: 5 0,-0.952; 10 0,0.952
CRYSTAL_2.5X2 = smd 0.9 x 0.75: 1 -0.825,-0.625; 2 0.825,-0.625; 3 0.825,0.625; 4 -0.825,0.625

### Placement (x,y rotation side)
ARGB  45,3 0 top
C1  65.02,9 270 top
C2  63,9 270 top
C3  52.04,9 270 top
C4  50.02,9 270 top
C5  48,9 270 top
C6  20,19 180 top
C7  20,21.02 180 top
C8  31.48,5.5 270 top
C9  40.01,13.98 0 top
C10  15,27 270 top
C11  21,27 90 top
C12  23.45,27 90 top
C13  29.45,27 90 top
C14  20,12 180 top
C15  33.5,5.5 270 top
C16  32,25 90 top
C17  40,16 0 top
C18  67.05,9 270 top
C19  56,28.3 180 top
C20  56,13.94 0 top
C21  49.9,14 270 top
C22  43,27 90 top
C23  56,24 0 top
C24  56,18 0 top
C25  52,24.5 0 top
C26  40.97,27 90 top
C27  47.8,14 270 top
C28  52,14 270 top
C29  6.08,21.5 270 top
C30  61,18.5 180 top
C31  18,8 0 top
C32  9.02,10 270 top
C33  11.05,18 270 top
C34  20,23.05 180 top
D1  51,3 180 top
D2  2,21.5 90 top
EEPROM  10.5,24 270 top
KB_MATRIX  25,3 0 top
LED  34.9,3.05 180 top
LM1117  58,6 0 top
LOGO1  61.75,21.25 0 bottom
R1  40.01,9.94 180 top
R2  40.01,11.96 180 top
R3  25,8 0 top
R4  56,26.15 180 top
R5  56,15.97 180 top
R6  53,21 90 top
R7  10.95,5 270 top
R8  13,5 90 top
R9  15.11,10.01 270 top
R10  36,5.5 270 top
R11  7,18 270 top
R12  7,10 90 top
R13  15.09,18 270 top
R14  13.08,10.01 270 top
R15  11.05,10.01 270 top
R16  4.06,21.5 90 top
R17  9.02,18 90 top
R18  13.07,18 90 top
R19  40.01,7.92 180 top
R20  40.01,5.9 180 top
RGB_PD  16,5 270 top
RST  1.98,17.95 0 top
STM32F405  30,15 315 top
SW2  3,15 180 top
SWD  4.5,10 0 bottom
TC  7.55,7 270 top
TP1  63.65,17.45 0 top
U1  15.08,14.01 0 top
U2  10,14 180 top
U3  39.5,3 90 top
U33  47,21 225 top
U$1  35,15 0 top
U$2  3,3 0 top
U$3  3,27 0 top
U$4  67,27 0 top
U$5  67,3 0 top
U$6  62.83,7.7 0 bottom
U$7  7,28 0 top
U$8  60,27 0 top
U$9  63,2 0 top
UDB  67,15 90 top
USBSEL  62,15 0 top
X1  18,27 0 top
X2  26.5,27 0 top
X3  56,21 270 top

### Tracks (layer width: path | path; a pad name or v marks a point on that pad's centre or on a via)
!FAULT
  Top 0.254: RGB_PD.4 13.88,3.62 13.35,4.15 R8.1
!RESET  (via drill 0.35)
  Top 0.254: v16.53,21.99 15.54,21.99 13.07,19.52 R18.2 C33.1 10.99,18.91 v10.99,20.05 | STM32F405.7 25.86,20.2 25.71,20.2 23.9,22.01 v21.99,22.01 | TC.3 6.41,4.46 3.25,7.58 v3.25,11.65
  Bottom 0.254: v10.99,20.05 v10.99,20.04 6.28,15.32 v6.28,13.5 6.28,12.78 4.77,11.27 3.63,11.27 v3.25,11.65 2.87,11.27 SWD.6 | v16.53,21.99 17.08,21.99 17.58,22.49 21.01,22.49 21.49,22.01 v21.99,22.01
ARGB5
  Top 0.254: R20.1 41.45,5.9 42.05,6.5 45.5,6.5 46.2,5.8 ARGB.3
ARGB_DATA  (via drill 0.35)
  Top 0.254: v34.86,21.26 34.53,20.93 34.21,20.93 33.78,20.5 33.73,20.5 STM32F405.59 | R19.2 v38.02,7.92 | v40.5,21.8 40.1,21.4 40.1,21.02 39.67,20.6 39.67,19.5 43.7,15.47 43.7,13.75 v42.95,13
  Bottom 0.254: v34.86,21.26 35.52,21.26 36.06,21.8 v40.5,21.8 | v42.95,13 42.95,12.85 v38.02,7.92
BOOT0  (via drill 0.35)
  Top 0.254: R11.2 7,15.35 7.85,14.5 v7.85,14 7.85,13.5 7,12.65 R12.2 C32.1 | v15.09,20 R13.1 16.4,18.85 19.55,15.7 v21.85,15.7 | STM32F405.60 33.49,20.96 33.49,21.29 v34.55,22.35
  Bottom 0.254: v7.85,14 11.35,17.5 12.59,17.5 v15.09,20 | v34.55,22.35 33.66,21.46 32.61,21.46 29.68,18.52 29.68,16.93 26.3,13.55 23.5,13.55 21.85,15.2 v21.85,15.7
BOOT1
  Top 0.254: STM32F405.28 25.85,8.38 R3.2
CLK  (via drill 0.35)
  Top 0.254: U33.14 43.75,23.17 43.75,25 44.45,25.7 v44.45,26.6 | STM32F405.21 25.9,13.38 v25.9,14.35
  Bottom 0.254: v25.9,14.35 26.35,14.35 29.05,17.05 29.05,18.65 35.4,25 41.45,25 43.05,26.6 v44.45,26.6
CS_EE  (via drill 0.35)
  Top 0.254: v10.05,23.1 v10.06,23.11 10.06,24.77 8.92,25.91 7.2,25.91 EEPROM.1 | STM32F405.15 23.05,17.35 22.35,17.35 21.96,16.96 19.78,16.96 v19.34,17.4
  Bottom 0.254: v19.34,17.4 15.69,21.05 11.25,21.05 10.05,22.25 v10.05,23.1
CS_MTX
  Top 0.254: STM32F405.24 24.81,10.16 23.65,10.16 22.74,9.26 22.74,7.26 23.1,6.9 27.07,6.9 27.71,6.26 27.71,5.89 28,5.6 KB_MATRIX.6
DATA0  (via drill 0.35)
  Top 0.254: U33.24 46.3,17.79 46.3,14.8 v46.25,14.75 | STM32F405.17 24.85,15.15 28.32,15.15 30.58,17.41 33.42,17.41 35.2,15.63 v35.2,14.25
  Bottom 0.254: v46.25,14.75 45.75,14.75 45.65,14.65 35.6,14.65 v35.2,14.25
DATA1  (via drill 0.35)
  Top 0.254: U33.23 45.55,17.75 45.55,15.55 v45.5,15.5 | STM32F405.26 27.46,11.4 v27.55,11.4
  Bottom 0.254: v45.5,15.5 45,15.5 44.7,15.2 35.05,15.2 30.65,10.8 28.15,10.8 v27.55,11.4
DATA2  (via drill 0.35)
  Top 0.254: U33.22 44.8,17.72 44.8,16.3 v44.75,16.25 | STM32F405.27 27.37,10.6 27.85,10.6 28.55,11.3 v28.55,11.7
  Bottom 0.254: v44.75,16.25 44.25,15.75 34.75,15.75 30.35,11.35 28.9,11.35 v28.55,11.7
DATA3  (via drill 0.35)
  Top 0.254: U33.21 44.05,17.69 44.05,17.05 v44,17 | STM32F405.29 28.07,9.89 28.07,9.94 29.65,11.52 29.65,12.95 30.1,13.4 31.2,13.4 v31.25,13.35
  Bottom 0.254: v44,17 43.3,16.3 34.55,16.3 31.9,13.65 31.55,13.65 v31.25,13.35
DATA4  (via drill 0.35)
  Top 0.254: U33.20 43.39,17.75 v43.25,17.75 | STM32F405.30 30.45,11.56 v30.45,12.6
  Bottom 0.254: v43.25,17.75 42.35,16.85 34.34,16.85 31.7,14.21 31.01,14.21 30.45,13.65 v30.45,12.6
DATA5  (via drill 0.35)
  Top 0.254: U33.19 43.47,18.55 42.55,18.55 v42.5,18.5 | STM32F405.33 30.65,9.05 30.65,10.49 32.11,11.94 32.11,14.07 31.07,15.12 31.07,15.77 31.55,16.25 v32.65,16.25
  Bottom 0.254: v42.5,18.5 41.4,17.4 34.15,17.4 33,16.25 v32.65,16.25
DATA6  (via drill 0.35)
  Top 0.254: U33.18 43.5,19.3 41.8,19.3 v41.75,19.25 | STM32F405.34 31.16,9.24 31.16,10.22 32.66,11.72 32.66,14.64 v31.85,15.45
  Bottom 0.254: v41.75,19.25 40.45,17.95 33.95,17.95 33.08,17.07 32.38,17.07 31.85,16.55 v31.85,15.45
DATA7  (via drill 0.35)
  Top 0.254: U33.17 43.54,20.05 41.05,20.05 v41,20 | STM32F405.57 v32.85,18.2
  Bottom 0.254: v32.85,18.2 33.35,18.2 33.65,18.5 39.5,18.5 v41,20
DIR  (via drill 0.35)
  Top 0.254: U33.12 44.85,23.51 44.85,24.6 46.3,26.05 v46.3,27.6 | STM32F405.10 25.99,17.95 26.25,17.95 v27.1,17.1
  Bottom 0.254: v46.3,27.6 45.6,28.3 43.25,28.3 41.06,26.11 34.96,26.11 27.1,18.25 v27.1,17.1
GND  (via drill 0.35)
  Top 0.254: U33.P$1 48.8,21 U33.2 U33.1 50.47,21 v51,21 | STM32F405.18 23.05,12.65 22.5,12.65 v22.05,13.1 | v25.2,16.5 25.2,17.32 STM32F405.12 24.1,18.43 v24.1,19.8 | USBSEL.5 v62,13 | TC.5 3.06,7 v2,7 | SW2.5 3,14.47 v2.98,14.49 | STM32F405.63 34.4,24 35.75,24 v36.4,23.35
  Bottom 0.254: v2,7 1.96,7.04 SWD.5
  other vias: 33.2,26.25 49,28 24.35,24.6 24.14,9.37 29.6,9.4 16,25 22.2,26.9 21.8,7.16 32.48,3.65 43.98,12.03 6.25,25.25 12.1,14.4 12,20.25 5.3,10.72 9.05,12.25 16.5,10.85 22.45,18.2 22.55,21.15 29.17,23.36 28.6,6.15 17.05,20.95 18,15 21.05,9.95 18.82,25.3 26.2,24.35 42,21 39.25,27.85 66.5,21.5 61,25 58.5,20.55 55.45,10.72 14.45,22.75 28.85,12.7 34.45,13.45 34.02,8.69 21,6.38 21,5.36 64.5,24 7.5,20.5 10,28.5 64.5,5.5 35.9,10.4 47,24.7 62.05,11 58.98,11 51.23,28.6 52,25.88 54.35,21.02 57.7,12.8 53.17,12.78 46.62,13.15 51.02,7.2 54.35,3.98 54.33,1.5 43.62,3.85 30.55,26.98 13.3,26.93 2.23,16.07 2,21.5 52.77,28.6 43.98,9.96 53.17,10.72 12.15,7.8
  pour Top (isolate 0.254): 3,0 0,3 0,27 3,30 67,30 70,27 70,3 67,0
  pour Bottom (isolate 0.254): 3,0 67,0 70,3 70,27 67,30 3,30 0,27 0,3
  pour Route2 (isolate 0.254): 3,30 67,30 70,27 70,3 67,0 3,0 0,3 0,27
  pour Route15 (isolate 0.254): 3,30 67,30 70,27 70,3 67,0 3,0 0,3 0,27
MISO  (via drill 0.35)
  Top 0.254: STM32F405.52 37.25,19.07 v37.25,20.25 37.25,20.8 38.35,21.9 38.35,25.85 37.4,26.8 v37.4,27.95 | v9.1,24.65 7.21,24.65 EEPROM.2 | KB_MATRIX.4 v25.6,6.1
  Bottom 0.254: v9.1,24.65 9.1,25.15 12.25,28.3 37.05,28.3 v37.4,27.95 | v37.25,20.25 36.75,20.25 36.45,19.95 32.65,19.95 30.75,18.05 30.75,16.45 25.6,11.3 v25.6,6.1
MOSI  (via drill 0.35)
  Top 0.254: STM32F405.53 35.85,18.38 35.85,18.43 36.45,19.02 v36.45,21 36.7,21 37.8,22.1 37.8,25.62 36.45,26.98 v36.45,27.5 | v11.35,22.1 12.79,22.1 EEPROM.5 | KB_MATRIX.3 v24.4,6.1
  Bottom 0.254: v11.35,22.1 11.35,26.55 12.55,27.75 36.2,27.75 v36.45,27.5 | v36.45,21 35.95,20.5 32.42,20.5 30.21,18.28 30.21,16.68 25.02,11.49 25.02,6.72 v24.4,6.1
N$1
  Top 0.254: STM32F405.44 37.53,9.94 R1.2
N$4
  Top 0.254: STM32F405.45 37.13,11.05 38.25,11.05 R2.2
N$5
  Top 0.254: R4.2 54.2,25.2 54.2,23.15 53.8,22.75 50.35,22.75 50.1,23 49.36,23 U33.4
N$6  (via drill 0.35)
  Top 0.254: C20.1 v53.95,13.94 | U33.29 49.96,18.4 v51.05,18.4
  Bottom 0.254: v53.95,13.94 52.38,15.52 52.38,16.75 51.45,17.68 51.45,18 v51.05,18.4
N$7
  Top 0.254: U33.26 50,16.2 C21.1
N$8
  Top 0.254: U33.15 43.2,23 43.2,25.2 43,25.4 C22.1
N$9
  Top 0.254: U33.28 50.14,17.5 51.23,17.5 52.05,18.32 52.05,21.65 52.25,21.85 R6.2 55.35,21.85 X3.1 55.38,22.68 55.15,22.9 C23.1
N$10  (via drill 0.35)
  Top 0.254: U33.27 49.97,16.95 51.62,16.95 52.6,17.93 52.6,18.9 53,19.3 R6.1 53.73,20.15 53.92,19.95 53.92,19.55 54.38,19.09 v55.15,19.09 | X3.3 56.62,19.57 56.14,19.09 v55.15,19.09 | C24.1 v55.15,19.09
N$11  (via drill 0.35)
  Top 0.254: D2.C 2.14,19.86 2.8,19.2 v3.3,19.2 | v5.8,19.2 6.15,18.85 R11.1
  Bottom 0.254: v5.8,19.2 5.35,19.65 3.75,19.65 v3.3,19.2
N$12
  Top 0.254: R10.2 35.84,4.65 34.24,3.05 LED.A
N$14
  Top 0.254: R7.2 10.95,3.25 11.95,2.25 15.4,2.25 16,2.85 RGB_PD.5
N$15
  Top 0.254: U2.3 10.03,13 12,13 | 12.3,12.7 13.08,11.92 R14.1 | 12.3,12.7 12,13 | 12.3,13.3 13.07,14.07 R18.1 | 12.3,13.3 12,13 | 12.3,12.7 12.3,13.3
N$16
  Top 0.254: U1.3 R13.2
N$17
  Top 0.254: U1.1 14.13,10.13 13.16,9.16 R14.2 R15.2
N$18  (via drill 0.35)
  Top 0.254: v42.8,7.35 42.23,7.92 R19.1 | v42.8,5.6 42.8,4.51 41.29,3 U3.2
  Bottom 0.254: v42.8,7.35 v42.8,5.6
N$19  (via drill 0.35)
  Top 0.254: v4.04,23.5 4.06,23.48 R16.2 | v9.02,19.99 R17.2 9.15,18.85 10,18 10,16.28 10.95,15.33 U2.1
  Bottom 0.254: v4.04,23.5 4.63,23.5 5.43,24.3 6.73,24.3 9.02,22.01 v9.02,19.99
N$20
  Top 0.254: SW2.1 1.57,14.2 2.65,15.28 3.38,15.28 4.45,14.2 SW2.4 5.65,14.2 6.17,14.72 6.17,16.29 RST.2 4.51,19.26 4.06,19.71 R16.1 3.33,20.65 3.08,20.9 3.08,22.95 2.89,23.14 D2.A
N$22
  Top 0.254: U3.4 38.41,4.31 39.16,5.06 R20.2
NXT  (via drill 0.35)
  Top 0.254: U33.11 45.41,23.67 45.41,24.43 47.31,26.33 v47.31,28.04 v47.3,28.05 | STM32F405.11 26.25,16.98 v26.25,16.5
  Bottom 0.254: v26.25,16.5 26.25,18.15 34.75,26.65 40.85,26.65 43.05,28.85 46.5,28.85 v47.3,28.05
OSC32_IN
  Top 0.254: X2.3 27.98,27.62 28.3,27.3 28.3,26.55 28.7,26.15 C13.1 29.45,25.45 28.85,24.85 28.02,24.85 27,23.82 27,21.91 27.88,21.03 STM32F405.3
OSC32_OUT
  Top 0.254: STM32F405.4 25.32,22.86 25.32,24.9 25.68,25.25 X2.1 24.88,26.38 24.65,26.15 C12.1
OSC_IN
  Top 0.254: STM32F405.5 26.27,21.2 26.22,21.2 22.38,25.05 21.35,25.05 21,25.4 C11.1 20.15,26.15 19.75,26.55 19.75,27.4 19.52,27.62 X1.3
OSC_OUT
  Top 0.254: STM32F405.6 26.07,20.7 25.97,20.7 22.14,24.52 18.23,24.52 17.18,25.57 X1.1 16.52,26.38 16.2,26.7 16.2,27.4 15.75,27.85 C10.1
P$1  (23 unrouted)
PWR5  (via drill 0.35)
  Top 0.254: RGB_PD.6 20.44,3.62 21.07,3 30,3 31.24,1.76 36.76,1.76 v37.35,2.35 U3.6 | ARGB.2 v45,3.9
  Bottom 0.254: v45,3.9 44.1,3 38,3 v37.35,2.35
RBIAS  (via drill 0.35)
  Top 0.254: R5.2 v54.01,15.97 | U33.32 50.56,19.95 v51,19.95
  Bottom 0.254: v51,19.95 51,19.55 51.96,18.59 51.96,17.92 53.91,15.97 v54.01,15.97
RGB_EN
  Top 0.254: STM32F405.58 32.94,19 32.55,19 31.5,17.95 30.35,17.95 28.11,15.71 24.6,15.71 23.19,14.3 18.88,14.3 17.52,12.95 17.52,10.53 16.16,9.16 R9.2 15.05,9.1 RGB_PD.3
SCK  (via drill 0.35)
  Top 0.254: v9.7,26.85 11.45,25.1 11.45,24 12.09,23.36 EEPROM.6 | KB_MATRIX.5 v26.8,6.1 | v38.3,28.46 38.3,26.68 38.9,26.08 38.9,21.7 38.05,20.85 v38.05,19.55 38.05,19.1 36.57,17.62 36.51,17.62 STM32F405.51
  Bottom 0.254: v9.7,26.85 9.85,26.85 11.86,28.86 37.9,28.86 v38.3,28.46 | v38.05,19.55 37.55,19.55 37.4,19.4 32.83,19.4 31.29,17.86 31.29,16.22 26.14,11.07 26.14,6.76 v26.8,6.1
STAT_LED
  Top 0.254: STM32F405.40 38.2,6.45 38.2,5.26 36.71,3.77 36.37,3.77 LED.C
STP  (via drill 0.35)
  Top 0.254: v45.4,27.1 45.4,25.9 44.3,24.8 44.3,23.34 U33.13 | STM32F405.8 27.6,17.75 v28.1,17.75
  Bottom 0.254: v28.1,17.75 28.1,18.45 35.2,25.55 41.25,25.55 43.45,27.75 44.75,27.75 v45.4,27.1
SWCLK  (via drill 0.35)
  Top 0.254: STM32F405.49 38.85,18.55 38.85,20.9 39.5,21.55 39.5,22.75 39.7,22.95 v39.7,23.4 | v20,2.51 19.45,1.96 16.59,1.96 15.78,1.14 11.6,1.14 11.35,1.39 v10.36,1.39 10.36,2.39 9.42,3.33 9.42,3.73 8.69,4.46 TC.4
  Bottom 0.254: v39.7,23.4 40.2,23.4 40.46,23.14 41.66,23.14 42.8,22 42.8,19.9 47.01,15.69 47.01,14.44 46.56,13.99 41.46,13.99 36.15,8.68 36.15,4.15 34.01,2.01 20.5,2.01 v20,2.51 | v10.36,1.39 10.36,2.44 8.25,4.55 6.4,4.55 4.5,6.45 SWD.3
SWDIO  (via drill 0.35)
  Top 0.254: STM32F405.46 37.04,11.85 v37.95,11.85 | v19,2.73 18.45,2.73 18.2,2.48 16.4,2.48 15.62,1.7 11.78,1.7 9.97,3.51 9.97,4 | 9.97,4 9.97,4.03 | v9.21,5.72 9.21,6.42 9.4,6.6 9.4,7.42 9.62,7.65 v10.2,7.65 | v9.21,5.72 9.21,4.75 9.97,4 | TC.2 v9.21,5.73 v9.21,5.72
  Bottom 0.254: v37.95,11.85 37.95,11.2 35.62,8.87 35.62,4.34 33.8,2.52 21.09,2.52 20.33,3.27 19.53,3.27 v19,2.73 | v10.2,7.65 10.2,8.98 7.91,11.27 SWD.2
USB0_N
  Top 0.254: UDB.2 64.88,14.4 64.53,14.75 USBSEL.7
USB0_P
  Top 0.254: UDB.3 64.88,15.6 64.53,15.25 USBSEL.8
USB1_N
  Top 0.254: USBSEL.2 60.57,15.25 59.05,13.73 59.05,12.32 58.22,11.49 45.99,11.49 45.23,10.73 41.53,10.73 40.86,10.06 R1.1
USB1_P
  Top 0.254: USBSEL.1 60.2,15.75 58.52,14.07 58.52,12.51 58.01,12 45.77,12 45.01,11.24 41.56,11.24 40.86,11.94 R2.1
USB2_N  (via drill 0.35)
  Top 0.254: v52,27.93 51.65,27.58 51.07,27.58 U33.8 | USBSEL.4 61.27,13.52 60.89,13.13 60.89,12.42 61.03,12.28 v61.03,11
  Bottom 0.254: v52,27.93 52.35,27.58 54.52,27.58 54.97,27.13 54.97,26.77 60.76,20.98 60.76,12.05 61.03,11.78 v61.03,11
USB2_P  (via drill 0.35)
  Top 0.254: U33.7 51.1,26.9 v52,26.9 | USBSEL.3 60.84,14.75 60.46,14.37 60.46,12.06 60,11.61 v60,11
  Bottom 0.254: v60,11 60,11.8 60.25,12.05 60.25,20.75 54.12,26.88 53.83,26.88 53.6,26.65 53.6,26.42 53.38,26.19 53.12,26.19 52.9,26.42 52.9,26.7 52.7,26.9 v52,26.9
USB_SELECT  (via drill 0.35)
  Top 0.254: USBSEL.9 63.05,15.75 63.65,16.35 v63.65,16.4 TP1.1 | STM32F405.62 34.31,23.2 35.05,23.2 v35.75,22.5 | v45,13 44.23,13.78 44.23,15.7 40.2,19.73 40.2,20.4 41.5,21.7 v41.5,22.2
  Bottom 0.254: v45,13 45,9.18 51.18,2.99 59.99,2.99 63.65,6.65 v63.65,16.4 | v41.5,22.2 41.1,22.6 40.05,22.6 39.95,22.5 v35.75,22.5
VCAP1
  Top 0.254: C8.1 30.8,6.35 30.33,6.83 29.15,6.83 28.68,7.3 28.05,7.3 27.63,7.72 27.63,8.03 STM32F405.31
VCAP2
  Top 0.254: STM32F405.47 36.95,12.65 37.83,12.65 C9.1
VCC_1  (via drill 0.35)
  Top 0.254: v14.1,7 14.1,6.95 R8.2 | 16.95,7 17.57,6.38 17.6,6.38
  Top 0.406: 56.85,26.2 R4.1
  Top 0.61: UDB.1 v66.75,13.2 66.8,13.15 66.8,11.15 67.05,10.9 C18.1 C1.1 C2.1 62.25,9.85 61.3,8.9 61.3,5.99 v60.31,5 | C31.1 16.9,7.75 16.95,7.63 16.95,7 RGB_PD.1 17.6,6.38 18.15,6.38 18.5,6.03 v18.5,6 | v51.6,1.5 52.05,1.5 52.64,2.09 D1.C 52.64,3.89 55.2,6.45 58.86,6.45 v60.31,5 | C19.1 v57.9,27.25 56.85,26.2 | LM1117.3 v60.31,5
  Bottom 0.254: v14.1,7 17.5,7 v18.5,6
  Bottom 0.61: v66.75,13.2 66.75,17.62 57.9,26.48 v57.9,27.25 | v51.6,1.5 51.42,1.32 19.05,1.32 18.05,2.32 18.05,5.55 v18.5,6
VCC_2  (via drill 0.35)
  Top 0.254: STM32F405.13 22.82,19 C6.1 | C6.1 C7.1 C34.1 20.88,23.02 v22.04,23.02 | STM32F405.19 23.11,12 C14.1 v20.85,13.15 | STM32F405.64 32,22.3 C16.1 | C6.1 v20.85,17.85 | U33.25 48.15,17.34 v48.15,16.3 47.8,15.95 C27.1 | C28.1 52,15.65 v51.6,16.05 | U33.31 50.3,19.5 v50.3,19.2 49.88,19.2 U33.30 | v58,5 LM1117.2 | D1.A 49.36,4.84 46.58,7.62 | 46.58,7.62 46.5,7.7 46.5,7.97 | 46.5,7.97 46.5,9.5 v46.85,9.85 C5.1 C4.1 C3.1 52.85,9.85 53.12,9.57 v53.73,9.57 54.2,9.1 LM1117.4 | U33.16 42.66,22.83 42.66,23.73 42.24,24.15 v41.35,24.15 40.97,24.53 C26.1 | EEPROM.8 EEPROM.7 14.21,24.64 v15.82,23.02 14.1,21.3 9.97,21.3 9.2,22.07 9.2,22.6 8.44,23.36 EEPROM.3 6.98,23.36 6.8,23.55 v6.01,23.55 v6.01,23.54 v6,23.53 6,22.66 6.08,22.58 C29.1 | KB_MATRIX.2 v23.2,6.1 | STM32F405.32 29.52,7.35 32.5,7.35 C15.1 v34.75,6.35 R10.1 v37.2,6.35 v37.21,6.36 | C17.1 37.85,14.7 v37.85,13.85 36.98,13.85 STM32F405.48 | U33.6 48.92,24 v49.95,24 50.45,24.5 C25.1 | STM32F405.1 27.83,22.47 27.83,23.11 v28.09,23.37 | TC.1 6.84,5.75 6.1,5.75 5.66,6.19 v5.66,7.55 4.3,7.55 3.77,8.07 3.77,11.03 4.22,11.47 v4.22,12.03 | v45.6,7.26 45.97,7.62 46.15,7.62 | 46.15,7.62 46.58,7.62 | 46.5,7.97 46.15,7.62 | v22.04,23.02 | C16.1 32.7,24.15 33.23,24.68 36.52,24.68 v37,24.2 | v30.8,24.15 C16.1 | 1.14,16 SW2.2 1.18,16.02 1.18,17.15 RST.1 4.12,15.8 SW2.3 | v58.65,16.98 v62,16.98 | C30.1 62,18.35 v62,16.98 | USBSEL.10 v62,16.98
  Bottom 0.254: v58,5 51.7,5 v46.85,9.85 46.85,12.2 48.15,13.5 v48.15,16.3 49.95,16.3 50.2,16.05 v51.6,16.05 | v37,24.2 37.55,24.2 37.8,24.45 40.55,24.45 40.85,24.15 v41.35,24.15 45.35,24.15 46.7,25.5 48.45,25.5 v49.95,24 49.95,23.45 50.2,23.2 50.2,19.75 50.3,19.65 v50.3,19.2 49.9,18.8 49.9,18.48 51.6,16.77 v51.6,16.05 | v51.6,16.05 51.6,11.1 53.12,9.57 v53.73,9.57 53.73,10.18 56.05,12.5 56.05,14.35 v58.65,16.98 | v37.85,13.85 35.1,11.1 35.1,6.7 v34.75,6.35 33.7,5.3 23.5,5.3 23.2,5.6 v23.2,6.1 23.2,10.8 v20.85,13.15 v20.85,17.85 26.37,23.37 v28.09,23.37 28.09,23.38 28.86,24.15 v30.8,24.15 | SWD.1 6.9,8.59 6.18,8.59 5.66,8.07 v5.66,7.55 | v37.21,6.36 38.92,4.65 42.99,4.65 v45.6,7.26 | v22.04,23.02 v15.82,23.02 | v15.82,23.02 | v6.01,23.54 1.98,19.5 RST.1 1.18,17.15 1.18,12.82 1.57,12.43 3.85,12.43 4.22,12.05 v4.22,12.03

### Text on the board
bPlace: https://c1k.it/sr42 | (c) 2024 Silvino Rodrigues | SR42 Keyboard MLB
tNames: (c) 2024 / Silvino Rodrigues | VCC | RST | GND | SWCLK | SWDIO
bNames: RST | SWDIO | GND | SWCLK | VCC